# Altium schematic sheet 14-GPS.SchDoc
size A4
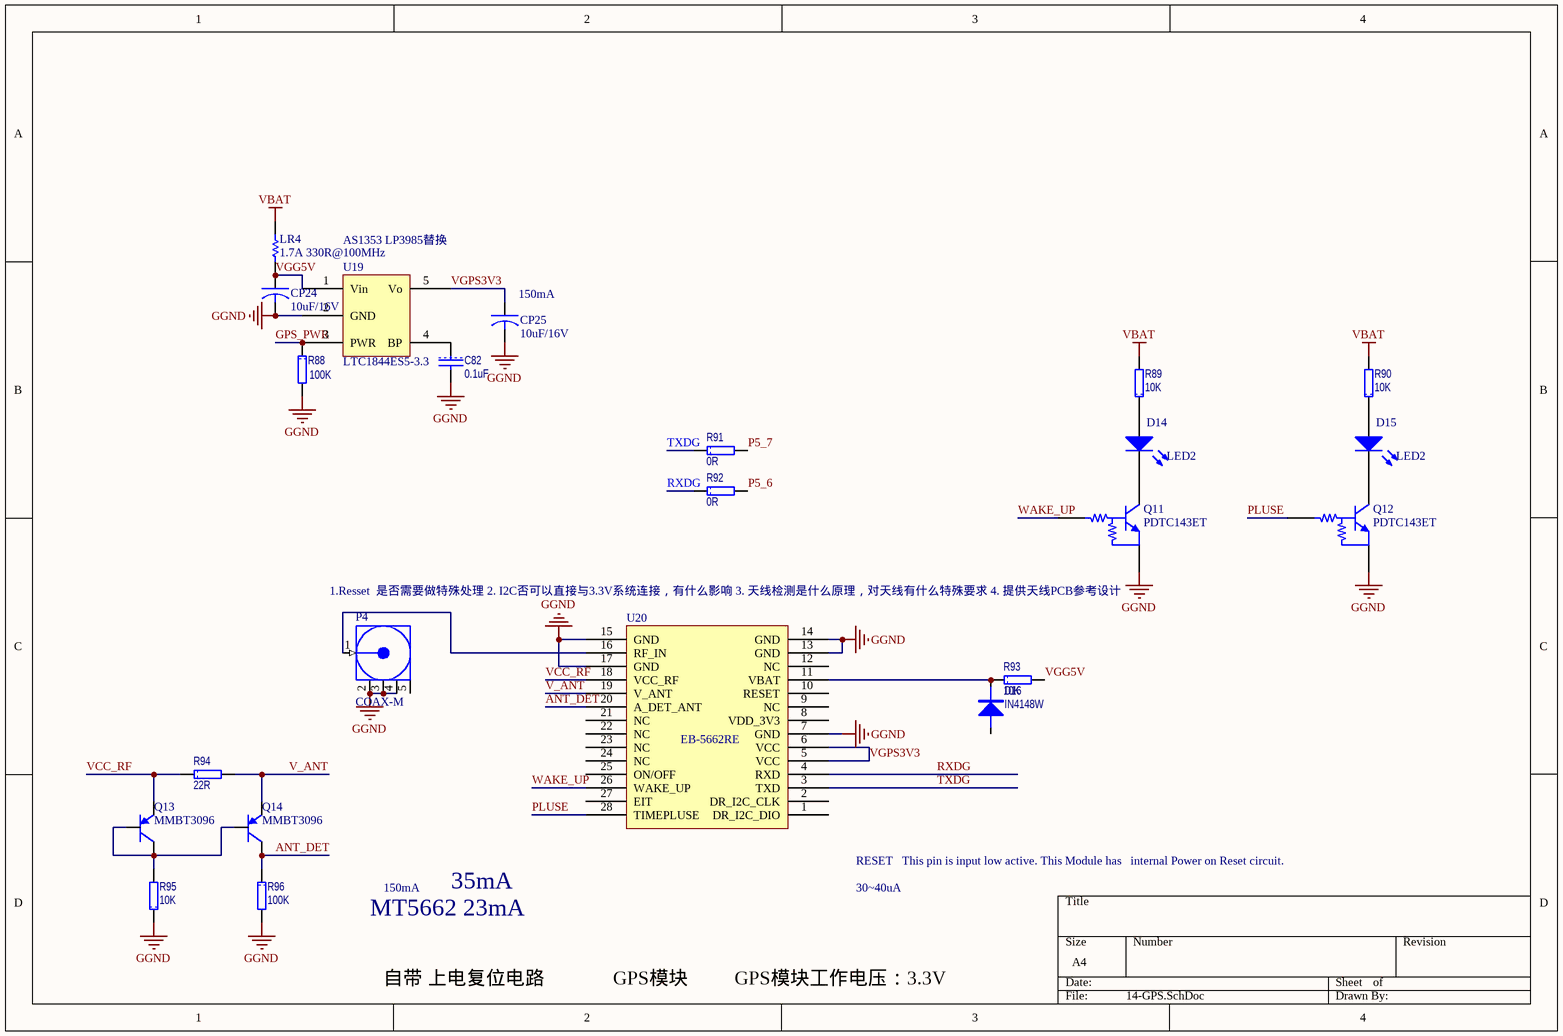
[diagram p0: 14-GPS.SchDoc]

## Parts
C82  0.1uF  [1608[0603]]
CP24  10uF/16V  [3216[1206]]
CP25  10uF/16V  [3216[1206]]
D14  LED2  [0805LED]
D15  LED2  [0805LED]
D16  IN4148W  [SOD123]
LR4  value 1.7A 330R@100MHz  [1608[0603]RV]  (hidden comment: MPZ1608S331A)
P4  COAX-M  [MHF[MCB3]-V4]
Q11  PDTC143ET  [SOT23_N]
Q12  PDTC143ET  [SOT23_N]
Q13  MMBT3096  [SOT23_N]
Q14  MMBT3096  [SOT23_N]
R88  100K  [1608[0603]R]
R89  10K  [1608[0603]R]
R90  10K  [1608[0603]R]
R91  0R  [1608[0603]R]
R92  0R  [1608[0603]R]
R93  10K  [1608[0603]R]
R94  22R  [1608[0603]R]
R95  10K  [1608[0603]R]
R96  100K  [1608[0603]R]
U19  LTC1844ES5-3.3  [SOT23-5BN]
U20  EB-5662RE  [EB-5662RE]

## Nets
GGND: C82.2 CP24.2 CP25.2 P4.2(GND) P4.3(GND) P4.4(GND) Q11.2(E) Q12.2(E) R88.2 R95.1 R96.2 U19.2(GND) U20.7(GND) U20.13(GND) U20.14(GND) U20.15(GND) U20.17(GND)
VBAT: LR4.2 R89.2 R90.2
ANT_DET: Q14.3 R96.1 U20.20(A_DET_ANT)
GPS_PWR: R88.1 U19.3(PWR)
P5_6: R92.2
P5_7: R91.2
PLUSE: Q12.1(B) U20.28(TIMEPLUSE)
RXDG: R92.1 U20.4(RXD)
TXDG: R91.1 U20.3(TXD)
V_ANT: Q14.2 R94.2 U20.19(V_ANT)
VCC_RF: Q13.2 R94.1 U20.18(VCC_RF)
VGG5V: CP24.1 LR4.1 R93.2 U19.1(Vin)
VGPS3V3: CP25.1 U19.5(Vo) U20.5(VCC) U20.6(VCC)
WAKE_UP: Q11.1(B) U20.26(WAKE_UP)
NetC82_1: C82.1 U19.4(BP)
NetD14_1: D14.1(A) R89.1
NetD14_2: D14.2(K) Q11.3(C)
NetD15_1: D15.1(A) R90.1
NetD15_2: D15.2(K) Q12.3(C)
NetD16_2: D16.2 R93.1 U20.11(VBAT)
NetP4_1: P4.1(Signal) U20.16(RF_IN)
NetQ13_1: Q13.1 Q13.3 Q14.1 R95.2

Not connected (* = marked no-connect by the designer): D16 1; P4 5(GND); U20 1(DR_I2C_DIO) 2(DR_I2C_CLK) 8(VDD_3V3) 9(NC) 10(RESET) 12(NC) 21(NC) 22(NC) 23(NC) 24(NC) 25(ON/OFF) 27(EIT)

## Notes on the sheet
- (near U19) AS1353 LP3985替换
- (near CP25) 150mA
- 1.Resset  是否需要做特殊处理 2. I2C否可以直接与3.3V系统连接，有什么影响 3. 天线检测是什么原理，对天线有什么特殊要求 4. 提供天线PCB参考设计
- MT5662 23mA
- 150mA
- 35mA
- RESET   This pin is input low active. This Module has   internal Power on Reset circuit.
- 30~40uA
- 自带 上电复位电路
- GPS模块
- GPS模块工作电压：3.3V

## Library data of the parts
C82 = CAP: Capacitor; Manufacturer: TDK; Type: 无铅电容; Model: C0603X7R1H104K; Value: 0.1uF
CP24 CP25 = CAPACITOR: Tantalum Capacitor; 公司: TAJ; name: TAJ-A-106-M-010-R; value: 10uF/16V
D14 D15 = LED2: Typical RED, GREEN, YELLOW, AMBER GaAs LED; Published: 8-Jun-2000; LatestRevisionDate: 17-Jul-2002; LatestRevisionNote: Re-released for DXP Platform.; PackageVersion: Feb-2002; PackageReference: 3.2X1.6X1.1; Publisher: Altium Limited; PackageDescription: SM LED; 2 Flat Leads
D16 = DIODE
LR4 = Res Semi: Semiconductor Resistor; 公司: TDK; Published: 8-Jun-2000; LatestRevisionDate: 17-Jul-2002; LatestRevisionNote: Re-released for DXP Platform.; PackageReference: AXIAL-0.5; Publisher: Altium Limited; PackageDescription: Axial Device, Thru-Hole; 2 Leads; 0.5 in Pin Spacing
P4 = COAX-M: RF Coaxial PCB Connector, MMCX; Thru-Hole, Vertical Mount Plug,  50 Ohm Impedance; PackageDocument: Rev. A, 16-Jun-1997; PCB_Layout: Complies with manufacturer's recommendation.; DrillSize: Corresponds to nominal value.; Published: 15-Jul-2004; LatestRevisionDate: 15-Jul-2004; LatestRevisionNote: Component Replaced.; DatasheetDocument: 30-May-2003; PackageReference: 908-21103; Publisher: Altium Limited; ComponentLink1Description: Manufacturer Link; ComponentLink1URL: http://www.amphenolrf.com/
Q11 Q12 = PDTC143ET: NPN Resistor-equipped Transistor; Published: 17-Sep-2003; LatestRevisionDate: 12-Dec-2006; LatestRevisionNote: IPC-7351 Footprint Added.; DatasheetVersion: 15-Apr-1999; PackageVersion: May-1999; PackageReference: SOT23; Publisher: Altium Limited; PackageDescription: 3-Pin SOT-23 Package 0.95 mm Pitch, 2.3 mm Lead Span; ComponentLink1Description: Manufacturer Link; ComponentLink1URL: http://www.semiconductors.philips.com/; ComponentLink2Description: Datasheet; ComponentLink2URL: http://www.semiconductors.philips.com/acrobat/datasheets/PDTC143E_SERIES_9.pdf
Q13 Q14 = MMBT3096: 三极管; 公司: NXP
R88 R96 = RES: Model: CRCW0603100K0KKEDTR; 公司: vishay; Parameters: 50V 1/10W 0.5%; Type: 无铅电阻; Value: 100K
R89 R90 R93 R95 = RES: Model: CRCW060310K0KKEDTR; 公司: vishay; Parameters: 50V 1/10W 0.5%; Type: 无铅电阻; Value: 10K
R91 R92 = RES: Model: RT0603DRD7D0RL; 公司: vishay; Parameters: 50V 1/10W 0.5%; Type: 无铅电阻; Value: 0R
R94 = RES: Model: RT0603DRD7D22RL; 公司: vishay; Parameters: 50V 1/10W 0.5%; Type: 无铅电阻; Value: 22R
U19 = LT1761: 电源管理; 公司: LTC
U20 = EB-5662RE: GPS模块; 公司: Globalsat